# Altium project fMUX_MB.PrjPCB (part 4 of 6)

## Sheet Mezz1.SchDoc: FPGA Motherboard for Digital Multiplexed Readout, McGill U.
size B; DocumentNumber: DfMUX26; Revision: Rev0, Prototype; SheetNumber: 26; SheetTotal: 27; PageSetup: Record=PageOptions|CenterHorizontal=True|CenterVertical=True|PrintScale=1.08|XCorrection=1.00|YCorrection=1.00|PrintKind=0|BorderSize=5000000|LeftOffset=0|BottomOffset=0|Orientation=2|PaperLength=1000|PaperWidth=1000|Scale=100|PaperSource=7|PrintQuality=-4|MediaType=1|DitherType=10|PaperKind=Tabloid|PrintScaleMode=1
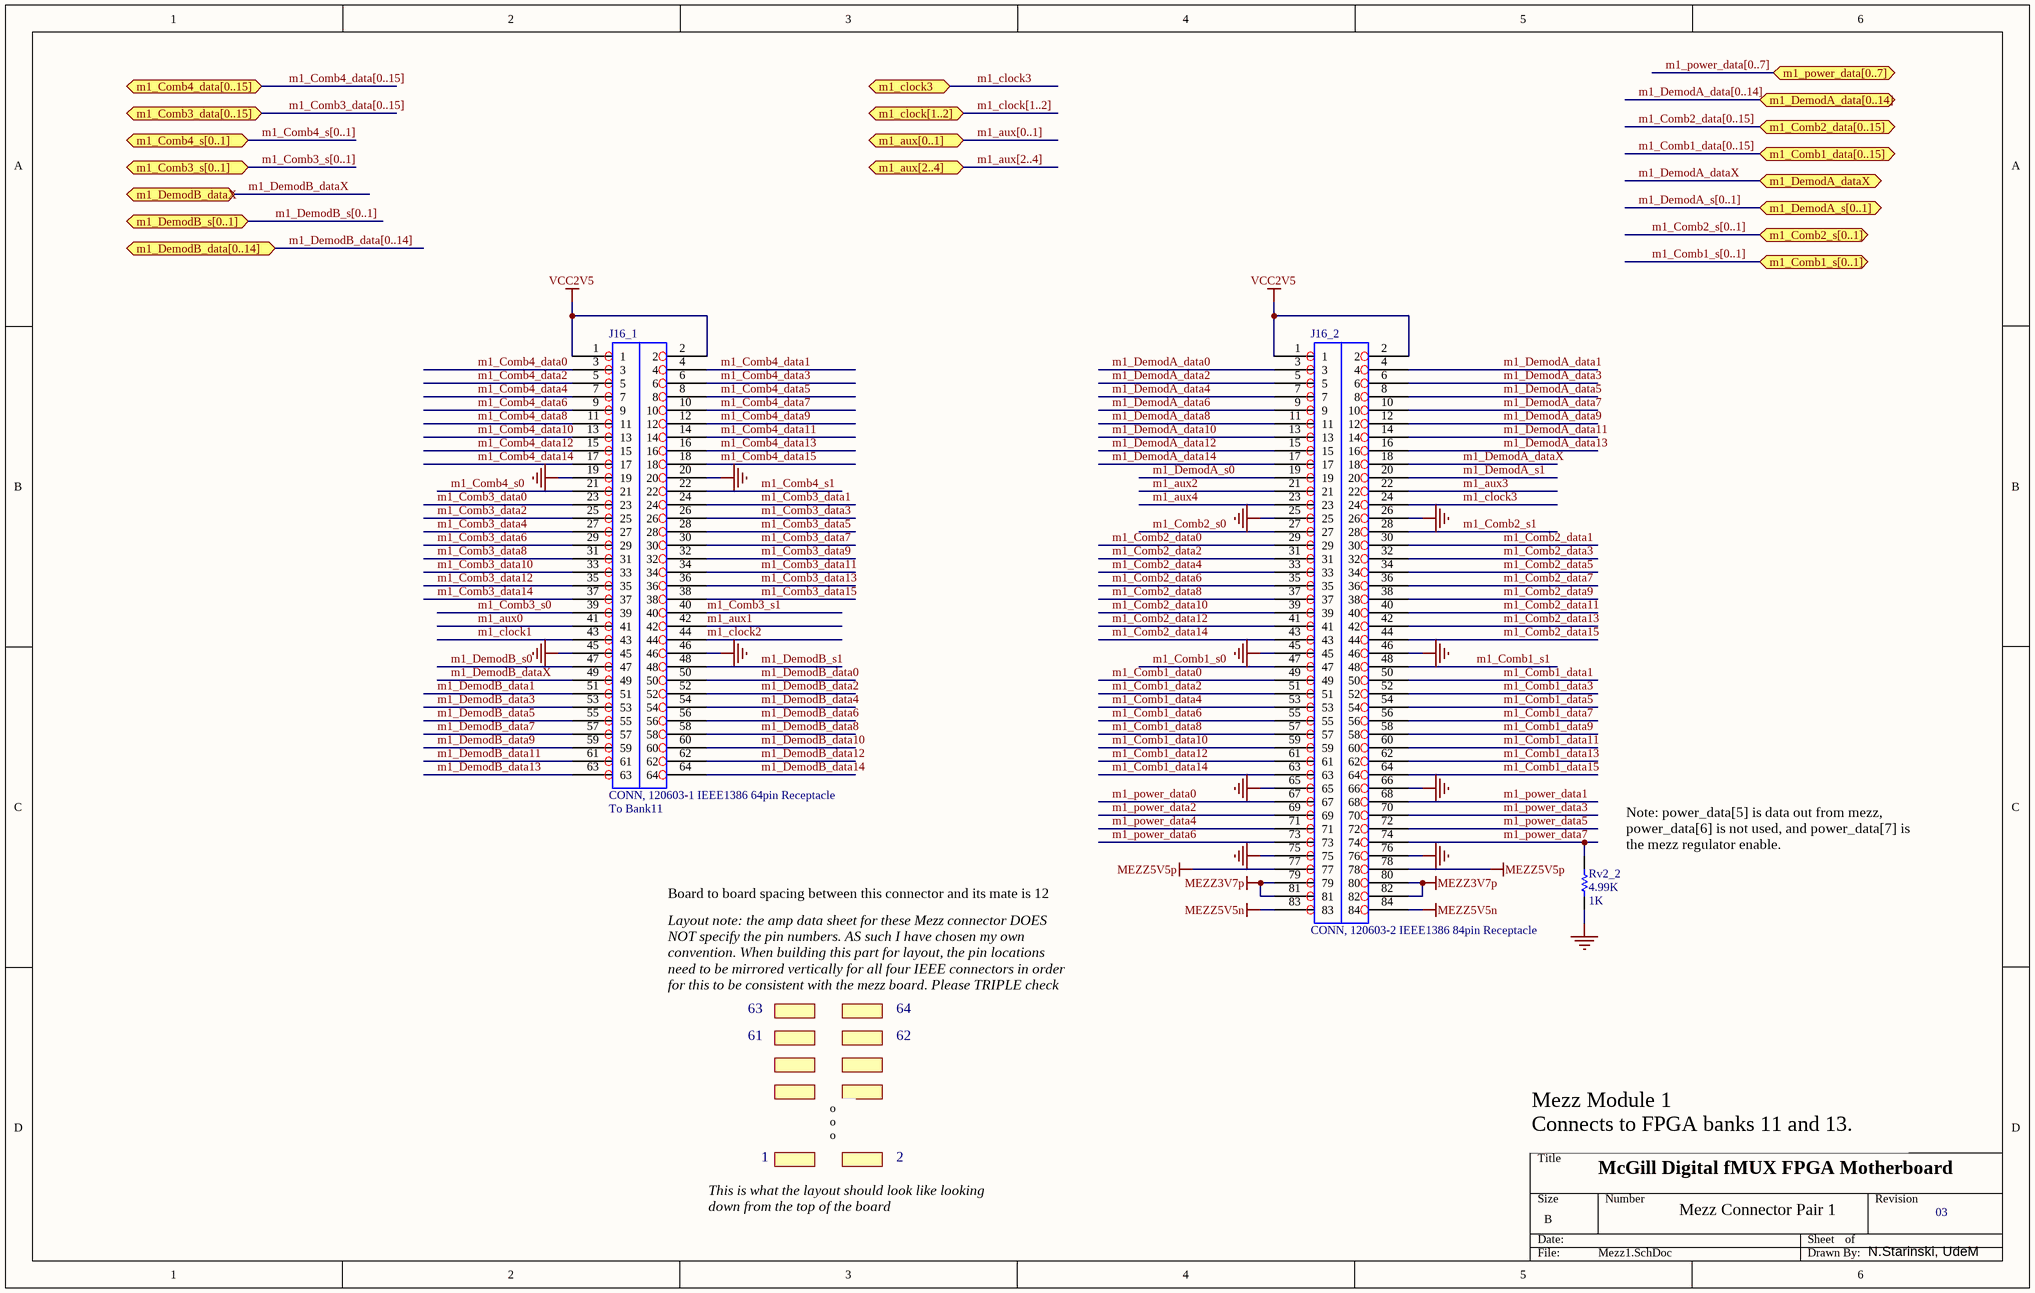
[diagram p20: Mezz1.SchDoc]

### Parts
J16_1  CONN, 120603-1 IEEE1386 64pin Receptacle  Relation: To Bank11  [120603-1]
J16_2  CONN, 120603-2 IEEE1386 84pin Receptacle  [120603-2]
Rv2_2  4.99K  value 1K  [1608[0603]]

### Ports
m1_aux[0..1] (bidir), m1_aux[2..4] (bidir), m1_clock3 (bidir), m1_clock[1..2] (bidir), m1_Comb1_data[0..15] (bidir), m1_Comb1_s[0..1] (bidir), m1_Comb2_data[0..15] (bidir), m1_Comb2_s[0..1] (bidir), m1_Comb3_data[0..15] (bidir), m1_Comb3_s[0..1] (bidir), m1_Comb4_data[0..15] (bidir), m1_Comb4_s[0..1] (bidir), m1_DemodA_data[0..14] (bidir), m1_DemodA_dataX (bidir), m1_DemodA_s[0..1] (bidir), m1_DemodB_data[0..14] (bidir), m1_DemodB_dataX (bidir), m1_DemodB_s[0..1] (bidir), m1_power_data[0..7]

### Nets
GND: J16_1.19 J16_1.20 J16_1.45 J16_1.46 J16_2.25 J16_2.26 J16_2.45 J16_2.46 J16_2.65 J16_2.66 J16_2.75 J16_2.76 Rv2_2.1
MEZZ3V7p: J16_2.79 J16_2.80 J16_2.81 J16_2.82  [project net Vout1]
MEZZ5V5n: J16_2.83 J16_2.84  [project net INT5V5n]
MEZZ5V5p: J16_2.77 J16_2.78  [project net INT5V5p]
VCC2V5: J16_1.1 J16_1.2 J16_2.1 J16_2.2  [project net Vout2]
m1_aux0: J16_1.41
m1_aux1: J16_1.42
m1_aux2: J16_2.21
m1_aux3: J16_2.22
m1_aux4: J16_2.23
m1_clock1: J16_1.43
m1_clock2: J16_1.44
m1_clock3: J16_2.24 ; port m1_clock3
m1_Comb1_data0: J16_2.49
m1_Comb1_data1: J16_2.50
m1_Comb1_data2: J16_2.51
m1_Comb1_data3: J16_2.52
m1_Comb1_data4: J16_2.53
m1_Comb1_data5: J16_2.54
m1_Comb1_data6: J16_2.55
m1_Comb1_data7: J16_2.56
m1_Comb1_data8: J16_2.57
m1_Comb1_data9: J16_2.58
m1_Comb1_data10: J16_2.59
m1_Comb1_data11: J16_2.60
m1_Comb1_data12: J16_2.61
m1_Comb1_data13: J16_2.62
m1_Comb1_data14: J16_2.63
m1_Comb1_data15: J16_2.64
m1_Comb1_s0: J16_2.47
m1_Comb1_s1: J16_2.48
m1_Comb2_data0: J16_2.29
m1_Comb2_data1: J16_2.30
m1_Comb2_data2: J16_2.31
m1_Comb2_data3: J16_2.32
m1_Comb2_data4: J16_2.33
m1_Comb2_data5: J16_2.34
m1_Comb2_data6: J16_2.35
m1_Comb2_data7: J16_2.36
m1_Comb2_data8: J16_2.37
m1_Comb2_data9: J16_2.38
m1_Comb2_data10: J16_2.39
m1_Comb2_data11: J16_2.40
m1_Comb2_data12: J16_2.41
m1_Comb2_data13: J16_2.42
m1_Comb2_data14: J16_2.43
m1_Comb2_data15: J16_2.44
m1_Comb2_s0: J16_2.27
m1_Comb2_s1: J16_2.28
m1_Comb3_data0: J16_1.23
m1_Comb3_data1: J16_1.24
m1_Comb3_data2: J16_1.25
m1_Comb3_data3: J16_1.26
m1_Comb3_data4: J16_1.27
m1_Comb3_data5: J16_1.28
m1_Comb3_data6: J16_1.29
m1_Comb3_data7: J16_1.30
m1_Comb3_data8: J16_1.31
m1_Comb3_data9: J16_1.32
m1_Comb3_data10: J16_1.33
m1_Comb3_data11: J16_1.34
m1_Comb3_data12: J16_1.35
m1_Comb3_data13: J16_1.36
m1_Comb3_data14: J16_1.37
m1_Comb3_data15: J16_1.38
m1_Comb3_s0: J16_1.39
m1_Comb3_s1: J16_1.40
m1_Comb4_data0: J16_1.3
m1_Comb4_data1: J16_1.4
m1_Comb4_data2: J16_1.5
m1_Comb4_data3: J16_1.6
m1_Comb4_data4: J16_1.7
m1_Comb4_data5: J16_1.8
m1_Comb4_data6: J16_1.9
m1_Comb4_data7: J16_1.10
m1_Comb4_data8: J16_1.11
m1_Comb4_data9: J16_1.12
m1_Comb4_data10: J16_1.13
m1_Comb4_data11: J16_1.14
m1_Comb4_data12: J16_1.15
m1_Comb4_data13: J16_1.16
m1_Comb4_data14: J16_1.17
m1_Comb4_data15: J16_1.18
m1_Comb4_s0: J16_1.21
m1_Comb4_s1: J16_1.22
m1_DemodA_data0: J16_2.3
m1_DemodA_data1: J16_2.4
m1_DemodA_data2: J16_2.5
m1_DemodA_data3: J16_2.6
m1_DemodA_data4: J16_2.7
m1_DemodA_data5: J16_2.8
m1_DemodA_data6: J16_2.9
m1_DemodA_data7: J16_2.10
m1_DemodA_data8: J16_2.11
m1_DemodA_data9: J16_2.12
m1_DemodA_data10: J16_2.13
m1_DemodA_data11: J16_2.14
m1_DemodA_data12: J16_2.15
m1_DemodA_data13: J16_2.16
m1_DemodA_data14: J16_2.17
m1_DemodA_dataX: J16_2.18 ; port m1_DemodA_dataX
m1_DemodA_s0: J16_2.19
m1_DemodA_s1: J16_2.20
m1_DemodB_data0: J16_1.50
m1_DemodB_data1: J16_1.51
m1_DemodB_data2: J16_1.52
m1_DemodB_data3: J16_1.53
m1_DemodB_data4: J16_1.54
m1_DemodB_data5: J16_1.55
m1_DemodB_data6: J16_1.56
m1_DemodB_data7: J16_1.57
m1_DemodB_data8: J16_1.58
m1_DemodB_data9: J16_1.59
m1_DemodB_data10: J16_1.60
m1_DemodB_data11: J16_1.61
m1_DemodB_data12: J16_1.62
m1_DemodB_data13: J16_1.63
m1_DemodB_data14: J16_1.64
m1_DemodB_dataX: J16_1.49 ; port m1_DemodB_dataX
m1_DemodB_s0: J16_1.47
m1_DemodB_s1: J16_1.48
m1_power_data0: J16_2.67
m1_power_data1: J16_2.68
m1_power_data2: J16_2.69
m1_power_data3: J16_2.70
m1_power_data4: J16_2.71
m1_power_data5: J16_2.72
m1_power_data6: J16_2.73
m1_power_data7: J16_2.74 Rv2_2.2

### Buses and harness runs
bus m1_aux[0..1] = port m1_aux[0..1]
bus m1_aux[2..4] = port m1_aux[2..4]
bus m1_clock[1..2] = port m1_clock[1..2]
bus m1_Comb1_data[0..15] = port m1_Comb1_data[0..15]
bus m1_Comb1_s[0..1] = port m1_Comb1_s[0..1]
bus m1_Comb2_data[0..15] = port m1_Comb2_data[0..15]
bus m1_Comb2_s[0..1] = port m1_Comb2_s[0..1]
bus m1_Comb3_data[0..15] = port m1_Comb3_data[0..15]
bus m1_Comb3_s[0..1] = port m1_Comb3_s[0..1]
bus m1_Comb4_data[0..15] = port m1_Comb4_data[0..15]
bus m1_Comb4_s[0..1] = port m1_Comb4_s[0..1]
bus m1_DemodA_data[0..14] = port m1_DemodA_data[0..14]
bus m1_DemodA_s[0..1] = port m1_DemodA_s[0..1]
bus m1_DemodB_data[0..14] = port m1_DemodB_data[0..14]
bus m1_DemodB_s[0..1] = port m1_DemodB_s[0..1]
bus m1_power_data[0..7] = port m1_power_data[0..7]

### Notes on the sheet
- Board to board spacing between this connector and its mate is 12 mm.
- (near Rv2_2) Note: power_data[5] is data out from mezz, power_data[6] is not used, and power_data[7] is the mezz regulator enable.
- Layout note: the amp data sheet for these Mezz connector DOES NOT specify the pin numbers. AS such I have chosen my own convention. When building this part for layout, the pin locations need to be mirrored vertically for all four IEEE connectors in order for this to be consistent with the mezz board. Please TRIPLE check that it mates properly with the mezz cards.
- 61
- 63
- 62
- 64
- 1
- o
  o
  o
- 2
- Mezz Module 1
  Connects to FPGA banks 11 and 13.
  Located on SYSACE side of board.
- McGill Digital fMUX FPGA Motherboard
- This is what the layout should look like looking down from the top of the board
- Mezz Connector Pair 1
- 03
- N.Starinski, UdeM

### Library data of the parts
J16_1 = 120603-1: 1.0mm FH (IEEE1386) 64-pin Connector
J16_2 = 120603-2: 1.0mm FH (IEEE1386) 84-pin Connector
Rv2_2 = Res Semi: Semiconductor Resistor; Published: 8-Jun-2000; LatestRevisionDate: 17-Jul-2002; LatestRevisionNote: Re-released for DXP Platform.; PackageReference: AXIAL-0.5; Publisher: Altium Limited

## Sheet Mezz2.SchDoc: FPGA Motherboard for Digital Multiplexed Readout, McGill U.
size B; DocumentNumber: DfMUX27; Revision: Rev0, Prototype; SheetNumber: 27; SheetTotal: 27; PageSetup: Record=PageOptions|CenterHorizontal=True|CenterVertical=True|PrintScale=1.08|XCorrection=1.00|YCorrection=1.00|PrintKind=0|BorderSize=5000000|LeftOffset=0|BottomOffset=0|Orientation=2|PaperLength=1000|PaperWidth=1000|Scale=100|PaperSource=7|PrintQuality=-4|MediaType=1|DitherType=10|PaperKind=Tabloid|PrintScaleMode=1
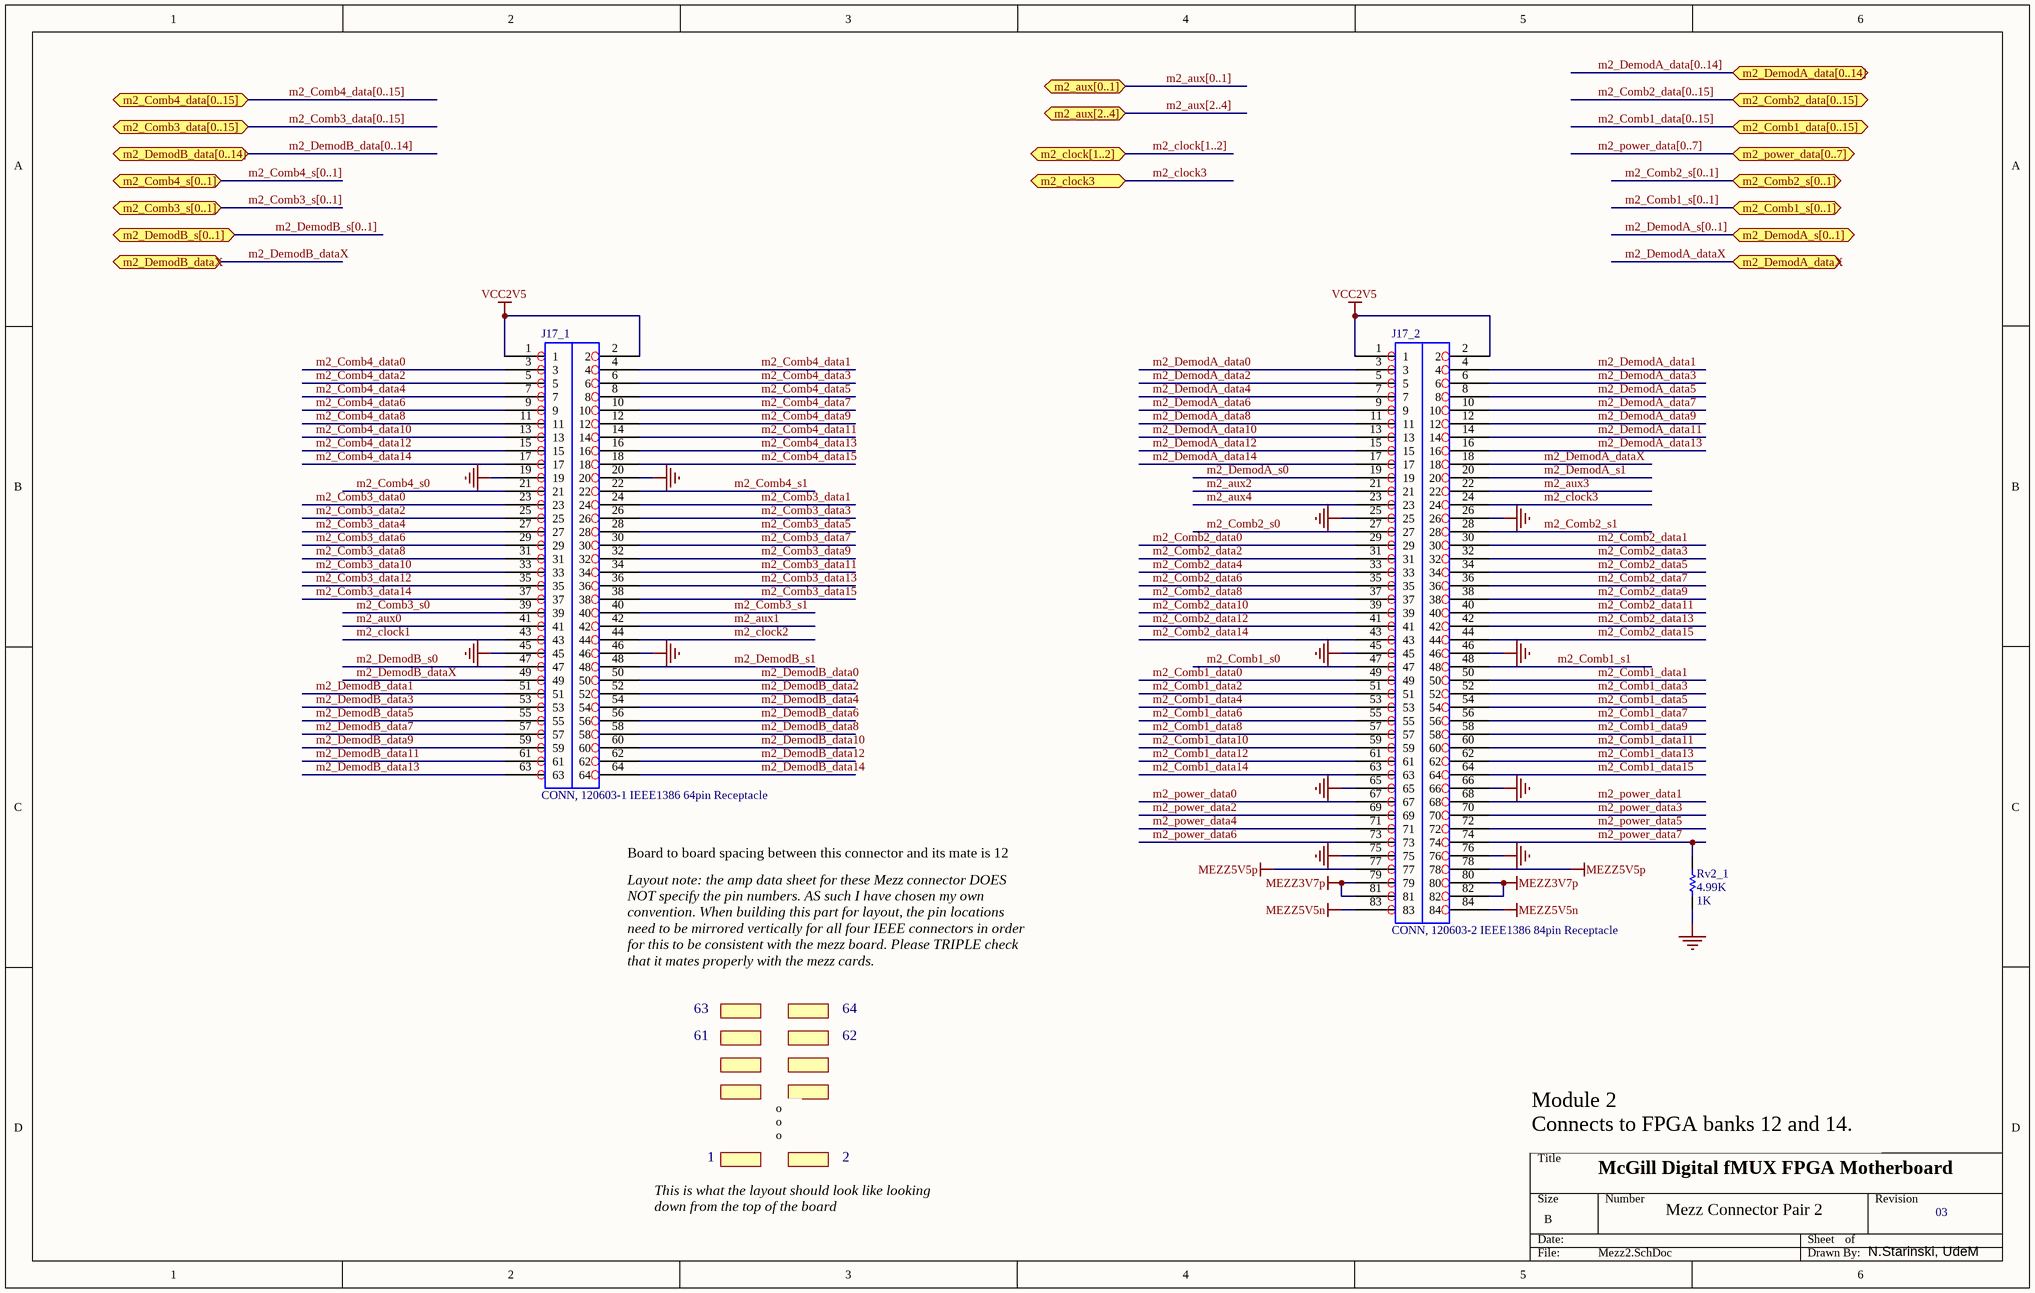
[diagram p21: Mezz2.SchDoc]

### Parts
J17_1  CONN, 120603-1 IEEE1386 64pin Receptacle  [120603-1]
J17_2  CONN, 120603-2 IEEE1386 84pin Receptacle  [120603-2]
Rv2_1  4.99K  value 1K  [1608[0603]]

### Ports
m2_aux[0..1] (bidir), m2_aux[2..4] (bidir), m2_clock3 (bidir), m2_clock[1..2] (bidir), m2_Comb1_data[0..15] (bidir), m2_Comb1_s[0..1] (bidir), m2_Comb2_data[0..15] (bidir), m2_Comb2_s[0..1] (bidir), m2_Comb3_data[0..15] (bidir), m2_Comb3_s[0..1] (bidir), m2_Comb4_data[0..15] (bidir), m2_Comb4_s[0..1] (bidir), m2_DemodA_data[0..14] (bidir), m2_DemodA_dataX (bidir), m2_DemodA_s[0..1] (bidir), m2_DemodB_data[0..14] (bidir), m2_DemodB_dataX (bidir), m2_DemodB_s[0..1] (bidir), m2_power_data[0..7] (bidir)

### Nets
GND: J17_1.19 J17_1.20 J17_1.45 J17_1.46 J17_2.25 J17_2.26 J17_2.45 J17_2.46 J17_2.65 J17_2.66 J17_2.75 J17_2.76 Rv2_1.1
MEZZ3V7p: J17_2.79 J17_2.80 J17_2.81 J17_2.82  [project net Vout1]
MEZZ5V5n: J17_2.83 J17_2.84  [project net INT5V5n]
MEZZ5V5p: J17_2.77 J17_2.78  [project net INT5V5p]
VCC2V5: J17_1.1 J17_1.2 J17_2.1 J17_2.2  [project net Vout2]
m2_aux0: J17_1.41
m2_aux1: J17_1.42
m2_aux2: J17_2.21
m2_aux3: J17_2.22
m2_aux4: J17_2.23
m2_clock1: J17_1.43
m2_clock2: J17_1.44
m2_clock3: J17_2.24 ; port m2_clock3
m2_Comb1_data0: J17_2.49
m2_Comb1_data1: J17_2.50
m2_Comb1_data2: J17_2.51
m2_Comb1_data3: J17_2.52
m2_Comb1_data4: J17_2.53
m2_Comb1_data5: J17_2.54
m2_Comb1_data6: J17_2.55
m2_Comb1_data7: J17_2.56
m2_Comb1_data8: J17_2.57
m2_Comb1_data9: J17_2.58
m2_Comb1_data10: J17_2.59
m2_Comb1_data11: J17_2.60
m2_Comb1_data12: J17_2.61
m2_Comb1_data13: J17_2.62
m2_Comb1_data14: J17_2.63
m2_Comb1_data15: J17_2.64
m2_Comb1_s0: J17_2.47
m2_Comb1_s1: J17_2.48
m2_Comb2_data0: J17_2.29
m2_Comb2_data1: J17_2.30
m2_Comb2_data2: J17_2.31
m2_Comb2_data3: J17_2.32
m2_Comb2_data4: J17_2.33
m2_Comb2_data5: J17_2.34
m2_Comb2_data6: J17_2.35
m2_Comb2_data7: J17_2.36
m2_Comb2_data8: J17_2.37
m2_Comb2_data9: J17_2.38
m2_Comb2_data10: J17_2.39
m2_Comb2_data11: J17_2.40
m2_Comb2_data12: J17_2.41
m2_Comb2_data13: J17_2.42
m2_Comb2_data14: J17_2.43
m2_Comb2_data15: J17_2.44
m2_Comb2_s0: J17_2.27
m2_Comb2_s1: J17_2.28
m2_Comb3_data0: J17_1.23
m2_Comb3_data1: J17_1.24
m2_Comb3_data2: J17_1.25
m2_Comb3_data3: J17_1.26
m2_Comb3_data4: J17_1.27
m2_Comb3_data5: J17_1.28
m2_Comb3_data6: J17_1.29
m2_Comb3_data7: J17_1.30
m2_Comb3_data8: J17_1.31
m2_Comb3_data9: J17_1.32
m2_Comb3_data10: J17_1.33
m2_Comb3_data11: J17_1.34
m2_Comb3_data12: J17_1.35
m2_Comb3_data13: J17_1.36
m2_Comb3_data14: J17_1.37
m2_Comb3_data15: J17_1.38
m2_Comb3_s0: J17_1.39
m2_Comb3_s1: J17_1.40
m2_Comb4_data0: J17_1.3
m2_Comb4_data1: J17_1.4
m2_Comb4_data2: J17_1.5
m2_Comb4_data3: J17_1.6
m2_Comb4_data4: J17_1.7
m2_Comb4_data5: J17_1.8
m2_Comb4_data6: J17_1.9
m2_Comb4_data7: J17_1.10
m2_Comb4_data8: J17_1.11
m2_Comb4_data9: J17_1.12
m2_Comb4_data10: J17_1.13
m2_Comb4_data11: J17_1.14
m2_Comb4_data12: J17_1.15
m2_Comb4_data13: J17_1.16
m2_Comb4_data14: J17_1.17
m2_Comb4_data15: J17_1.18
m2_Comb4_s0: J17_1.21
m2_Comb4_s1: J17_1.22
m2_DemodA_data0: J17_2.3
m2_DemodA_data1: J17_2.4
m2_DemodA_data2: J17_2.5
m2_DemodA_data3: J17_2.6
m2_DemodA_data4: J17_2.7
m2_DemodA_data5: J17_2.8
m2_DemodA_data6: J17_2.9
m2_DemodA_data7: J17_2.10
m2_DemodA_data8: J17_2.11
m2_DemodA_data9: J17_2.12
m2_DemodA_data10: J17_2.13
m2_DemodA_data11: J17_2.14
m2_DemodA_data12: J17_2.15
m2_DemodA_data13: J17_2.16
m2_DemodA_data14: J17_2.17
m2_DemodA_dataX: J17_2.18 ; port m2_DemodA_dataX
m2_DemodA_s0: J17_2.19
m2_DemodA_s1: J17_2.20
m2_DemodB_data0: J17_1.50
m2_DemodB_data1: J17_1.51
m2_DemodB_data2: J17_1.52
m2_DemodB_data3: J17_1.53
m2_DemodB_data4: J17_1.54
m2_DemodB_data5: J17_1.55
m2_DemodB_data6: J17_1.56
m2_DemodB_data7: J17_1.57
m2_DemodB_data8: J17_1.58
m2_DemodB_data9: J17_1.59
m2_DemodB_data10: J17_1.60
m2_DemodB_data11: J17_1.61
m2_DemodB_data12: J17_1.62
m2_DemodB_data13: J17_1.63
m2_DemodB_data14: J17_1.64
m2_DemodB_dataX: J17_1.49 ; port m2_DemodB_dataX
m2_DemodB_s0: J17_1.47
m2_DemodB_s1: J17_1.48
m2_power_data0: J17_2.67
m2_power_data1: J17_2.68
m2_power_data2: J17_2.69
m2_power_data3: J17_2.70
m2_power_data4: J17_2.71
m2_power_data5: J17_2.72
m2_power_data6: J17_2.73
m2_power_data7: J17_2.74 Rv2_1.2

### Buses and harness runs
bus m2_aux[0..1] = port m2_aux[0..1]
bus m2_aux[2..4] = port m2_aux[2..4]
bus m2_clock[1..2] = port m2_clock[1..2]
bus m2_Comb1_data[0..15] = port m2_Comb1_data[0..15]
bus m2_Comb1_s[0..1] = port m2_Comb1_s[0..1]
bus m2_Comb2_data[0..15] = port m2_Comb2_data[0..15]
bus m2_Comb2_s[0..1] = port m2_Comb2_s[0..1]
bus m2_Comb3_data[0..15] = port m2_Comb3_data[0..15]
bus m2_Comb3_s[0..1] = port m2_Comb3_s[0..1]
bus m2_Comb4_data[0..15] = port m2_Comb4_data[0..15]
bus m2_Comb4_s[0..1] = port m2_Comb4_s[0..1]
bus m2_DemodA_data[0..14] = port m2_DemodA_data[0..14]
bus m2_DemodA_s[0..1] = port m2_DemodA_s[0..1]
bus m2_DemodB_data[0..14] = port m2_DemodB_data[0..14]
bus m2_DemodB_s[0..1] = port m2_DemodB_s[0..1]
bus m2_power_data[0..7] = port m2_power_data[0..7]

### Notes on the sheet
- Board to board spacing between this connector and its mate is 12 mm.
- Layout note: the amp data sheet for these Mezz connector DOES NOT specify the pin numbers. AS such I have chosen my own convention. When building this part for layout, the pin locations need to be mirrored vertically for all four IEEE connectors in order for this to be consistent with the mezz board. Please TRIPLE check that it mates properly with the mezz cards.
- 61
- 63
- 62
- 64
- 1
- o
  o
  o
- 2
- Module 2
  Connects to FPGA banks 12 and 14.
  Located on DDR side of board.
- McGill Digital fMUX FPGA Motherboard
- This is what the layout should look like looking down from the top of the board
- Mezz Connector Pair 2
- 03
- N.Starinski, UdeM

### Library data of the parts
J17_1 = 120603-1: 1.0mm FH (IEEE1386) 64-pin Connector
J17_2 = 120603-2: 1.0mm FH (IEEE1386) 84-pin Connector
Rv2_1 = Res Semi: Semiconductor Resistor; Published: 8-Jun-2000; LatestRevisionDate: 17-Jul-2002; LatestRevisionNote: Re-released for DXP Platform.; PackageReference: AXIAL-0.5; Publisher: Altium Limited

## Sheet SysACE_SysFLASH.SchDoc: FPGA Motherboard for Digital Multiplexed Readout, McGill U.
size B; DocumentNumber: DfMUX10; Revision: Rev0, Prototype; SheetNumber: 10; SheetTotal: 27; PageSetup: Record=PageOptions|CenterHorizontal=True|CenterVertical=True|PrintScale=1.08|XCorrection=1.00|YCorrection=1.00|PrintKind=0|BorderSize=5000000|LeftOffset=0|BottomOffset=0|Orientation=2|PaperLength=1000|PaperWidth=1000|Scale=100|PaperSource=7|PrintQuality=-4|MediaType=1|DitherType=10|PaperKind=Tabloid|PrintScaleMode=1
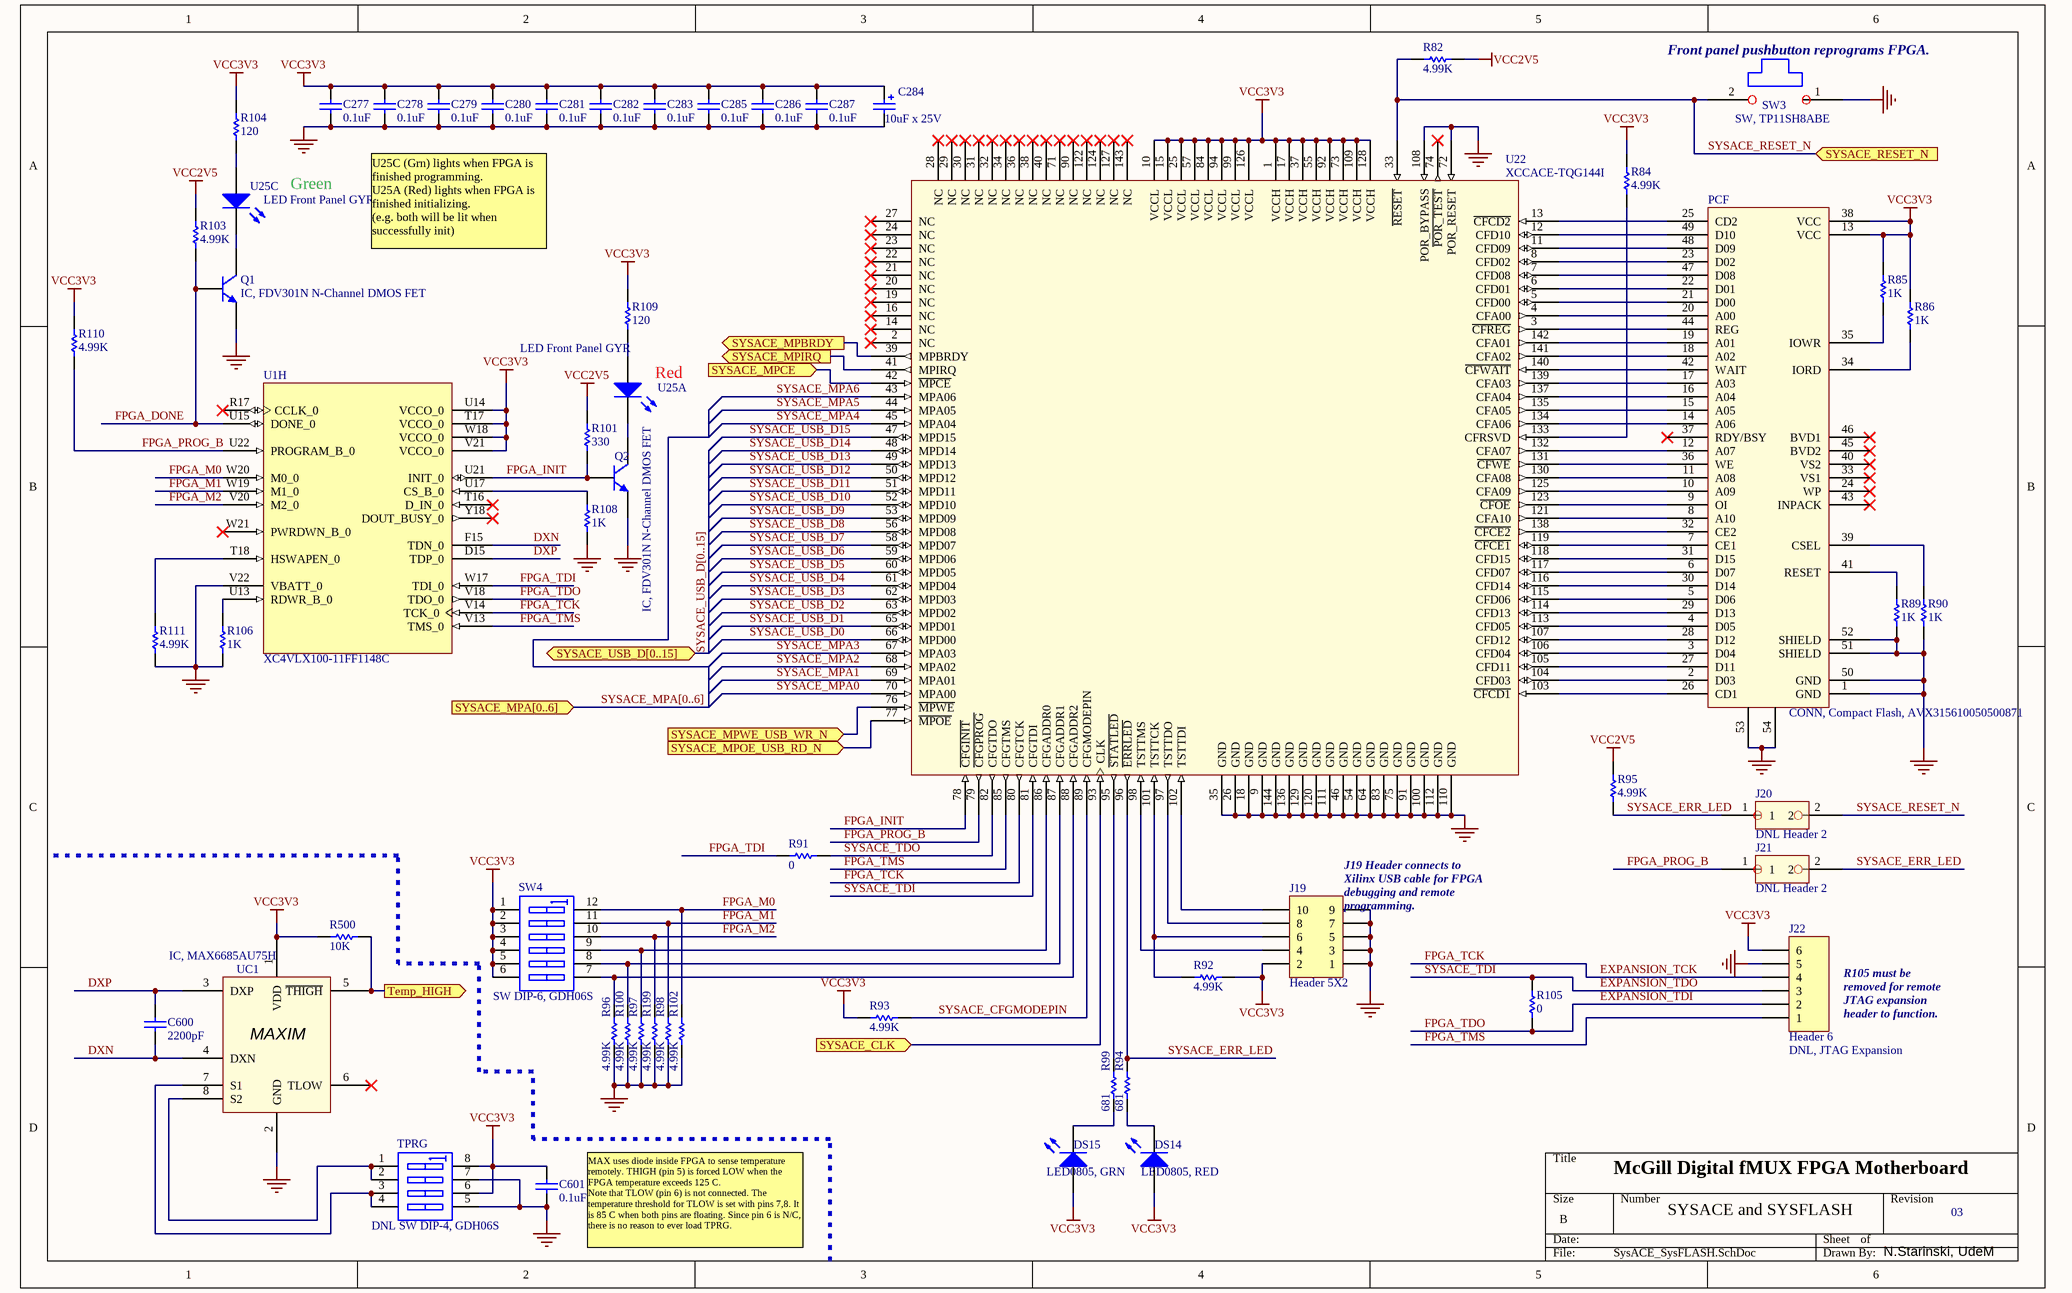
[diagram p22: SysACE_SysFLASH.SchDoc]

### Parts
C277  0.1uF  [CC1608-0603]
C278  0.1uF  [CC1608-0603]
C279  0.1uF  [CC1608-0603]
C280  0.1uF  [CC1608-0603]
C281  0.1uF  [CC1608-0603]
C282  0.1uF  [CC1608-0603]
C283  0.1uF  [CC1608-0603]
C284  10uF x 25V  [TC6032-2412]
C285  0.1uF  [CC1608-0603]
C286  0.1uF  [CC1608-0603]
C287  0.1uF  [CC1608-0603]
C600  2200pF  [CC1608-0603]
C601  0.1uF  [CC1608-0603]
DS14  LED0805, RED  [SMD _LED]
DS15  LED0805, GRN  [SMD _LED]
J19  Header 5X2  [HDR2X5]
J20  DNL Header 2  [HDR1X2]
J21  DNL Header 2  [HDR1X2]
J22  Header 6  Assembly: DNL, JTAG Expansion  [HDR1X6]
PCF  CONN, Compact Flash, AVX315610050500871  [CF_AVX5611]
Q1  IC, FDV301N N-Channel DMOS FET  [SOT23]
Q2  IC, FDV301N N-Channel DMOS FET  [SOT23]
R82  4.99K  [CR1608-0603]
R84  4.99K  [CR1608-0603]
R85  1K  [CR1608-0603]
R86  1K  [CR1608-0603]
R89  1K  [CR1608-0603]
R90  1K  [CR1608-0603]
R91  0  [CR1608-0603]
R92  4.99K  [CR1608-0603]
R93  4.99K  [CR1608-0603]
R94  681  [CR1608-0603]
R95  4.99K  [CR1608-0603]
R96  4.99K  [CR1608-0603]
R97  4.99K  [CR1608-0603]
R98  4.99K  [CR1608-0603]
R99  681  [CR1608-0603]
R100  4.99K  [CR1608-0603]
R101  330  [CR1608-0603]
R102  4.99K  [CR1608-0603]
R103  4.99K  [CR1608-0603]
R104  120  [CR1608-0603]
R105  0  [CR1608-0603]
R106  1K  [CR1608-0603]
R108  1K  [CR1608-0603]
R109  120  [CR1608-0603]
R110  4.99K  [CR1608-0603]
R111  4.99K  [CR1608-0603]
R199  4.99K  [CR1608-0603]
R500  10K  [CR1608-0603]
SW3  SW, TP11SH8ABE  [TP11SH8ABE]
SW4  SW DIP-6, GDH06S  [DIP_SW_SM6POS]
TPRG  DNL SW DIP-4, GDH06S  [SO-G8]
U1  XC4VLX100-11FF1148C  [FF1148]  (part H of 10)
U22  XCCACE-TQG144I  [TQFP144]
U25  LED Front Panel GYR  [LED_Tri_]  (parts A,C of 3)
UC1  IC, MAX6685AU75H  [uSOP8]

### Ports
SYSACE_CLK (in), SYSACE_MPA[0..6] (in), SYSACE_MPBRDY (out), SYSACE_MPCE (in), SYSACE_MPIRQ (out), SYSACE_MPOE_USB_RD_N (in), SYSACE_MPWE_USB_WR_N (in), SYSACE_RESET_N (in), SYSACE_USB_D[0..15], Temp_HIGH (out)

### Nets
GND: C277.1 C278.1 C279.1 C280.1 C281.1 C282.1 C283.1 C284.2 C285.1 C286.1 C287.1 C601.1 J19.1 J19.3 J19.5 J19.7 J19.9 J22.5 PCF.1(GND) PCF.50(GND) PCF.51(SHIELD) PCF.52(SHIELD) PCF.53(GND) PCF.54(GND) Q1.2(E) Q2.2(E) R89.1 R90.1 R96.1 R97.1 R98.1 R100.1 R102.1 R106.1 R108.1 R111.1 R199.1 SW3.1 TPRG.5(B4) TPRG.7(B2) U1.V22(VBATT_0) U22.9(GND) U22.18(GND) U22.26(GND) U22.35(GND) U22.46(GND) U22.54(GND) U22.64(GND) U22.72(POR_RESET) U22.75(GND) U22.83(GND) U22.91(GND) U22.100(GND) U22.108(POR_BYPASS) U22.110(GND) U22.111(GND) U22.112(GND) U22.120(GND) U22.129(GND) U22.136(GND) U22.144(GND) UC1.2(GND)
VCC2V5: R82.2 R95.2 R101.2 R103.2  [project net Vout2]
VCC3V3: C277.2 C278.2 C279.2 C280.2 C281.2 C282.2 C283.2 C284.1 C285.2 C286.2 C287.2 C601.2 DS14.1(A) DS15.1(A) J19.2 J22.6 PCF.13(VCC) PCF.38(VCC) R84.2 R85.2 R86.2 R92.2 R93.1 R104.2 R109.2 R110.2 R500.1 SW4.1(A1) SW4.2(A2) SW4.3(A3) SW4.4(A4) SW4.5(A5) SW4.6(A6) TPRG.6(B3) TPRG.8(B1) U1.T17(VCCO_0) U1.U14(VCCO_0) U1.V21(VCCO_0) U1.W18(VCCO_0) U22.1(VCCH) U22.10(VCCL) U22.15(VCCL) U22.17(VCCH) U22.25(VCCL) U22.37(VCCH) U22.55(VCCH) U22.57(VCCL) U22.73(VCCH) U22.84(VCCL) U22.92(VCCH) U22.94(VCCL) U22.99(VCCL) U22.109(VCCH) U22.126(VCCL) U22.128(VCCH) UC1.1(VDD)
DXN: C600.1 U1.F15(TDN_0) UC1.4(DXN)  [project net DXN_10]
DXP: C600.2 U1.D15(TDP_0) UC1.3(DXP)  [project net DXP_10]
EXPANSION_TCK: J22.4 U1.V14(TCK_0) U22.80(CFGTCK)  [also labelled FPGA_TCK]  [project net EXPANSION_TCK_10]
EXPANSION_TDI: J22.2 R105.1 U1.V18(TDO_0)  [also labelled FPGA_TDO]  [project net EXPANSION_TDI_10]
EXPANSION_TDO: J22.3 R105.2 U22.81(CFGTDI)  [also labelled SYSACE_TDI]  [project net EXPANSION_TDO_10]
FPGA_DONE: Q1.1(B) R103.1 U1.U15(DONE_0)  [project net FPGA_DONE_10]
FPGA_INIT: Q2.1(B) R101.1 U1.U21(INIT_0) U22.78(~{CFGINIT})  [project net FPGA_INIT_10]
FPGA_M0: R102.2 SW4.12(B1) U1.W20(M0_0)  [project net FPGA_M0_10]
FPGA_M1: R98.2 SW4.11(B2) U1.W19(M1_0)  [project net FPGA_M1_10]
FPGA_M2: R199.2 SW4.10(B3) U1.V20(M2_0)  [project net FPGA_M2_10]
FPGA_PROG_B: J21.1 R110.1 U1.U22(PROGRAM_B_0) U22.79(~{CFGPROG})  [project net FPGA_PROG_B_10]
FPGA_TDI: R91.1 U1.W17(TDI_0)  [project net FPGA_TDI_10]
FPGA_TMS: J22.1 U1.V13(TMS_0) U22.85(CFGTMS)  [project net FPGA_TMS_10]
SYSACE_CFGMODEPIN: R93.2 U22.89(CFGMODEPIN)  [project net SYSACE_CFGMODEPIN_10]
SYSACE_CLK: U22.93(CLK) ; port SYSACE_CLK
SYSACE_ERR_LED: J20.1 J21.2 R94.2 R95.1 U22.96(~{ERRLED})  [project net SYSACE_ERR_LED_10]
SYSACE_MPA0: U22.70(MPA00)
SYSACE_MPA1: U22.69(MPA01)
SYSACE_MPA2: U22.68(MPA02)
SYSACE_MPA3: U22.67(MPA03)
SYSACE_MPA4: U22.45(MPA04)
SYSACE_MPA5: U22.44(MPA05)
SYSACE_MPA6: U22.43(MPA06)
SYSACE_MPBRDY: U22.39(MPBRDY) ; port SYSACE_MPBRDY
SYSACE_MPCE: U22.42(~{MPCE}) ; port SYSACE_MPCE
SYSACE_MPIRQ: U22.41(MPIRQ) ; port SYSACE_MPIRQ
SYSACE_MPOE_USB_RD_N: U22.77(~{MPOE}) ; port SYSACE_MPOE_USB_RD_N
SYSACE_MPWE_USB_WR_N: U22.76(~{MPWE}) ; port SYSACE_MPWE_USB_WR_N
SYSACE_RESET_N: J20.2 R82.1 SW3.2 U22.33(~{RESET}) ; port SYSACE_RESET_N
SYSACE_TDO: R91.2 U22.82(CFGTDO)  [project net SYSACE_TDO_10]
SYSACE_USB_D0: U22.66(MPD00)
SYSACE_USB_D1: U22.65(MPD01)
SYSACE_USB_D2: U22.63(MPD02)
SYSACE_USB_D3: U22.62(MPD03)
SYSACE_USB_D4: U22.61(MPD04)
SYSACE_USB_D5: U22.60(MPD05)
SYSACE_USB_D6: U22.59(MPD06)
SYSACE_USB_D7: U22.58(MPD07)
SYSACE_USB_D8: U22.56(MPD08)
SYSACE_USB_D9: U22.53(MPD09)
SYSACE_USB_D10: U22.52(MPD10)
SYSACE_USB_D11: U22.51(MPD11)
SYSACE_USB_D12: U22.50(MPD12)
SYSACE_USB_D13: U22.49(MPD13)
SYSACE_USB_D14: U22.48(MPD14)
SYSACE_USB_D15: U22.47(MPD15)
Temp_HIGH: R500.2 UC1.5(~{THIGH}) ; port Temp_HIGH
NetDS14_2: DS14.2(K) R94.1
NetDS15_2: DS15.2(K) R99.1
NetJ19_4: J19.4 U22.98(TSTTMS)
NetJ19_6: J19.6 R92.1 U22.101(TSTTCK)
NetJ19_8: J19.8 U22.97(TSTTDO)
NetJ19_10: J19.10 U22.102(TSTTDI)
NetPCF_2: PCF.2(D03) U22.104(CFD03)
NetPCF_3: PCF.3(D04) U22.106(CFD04)
NetPCF_4: PCF.4(D05) U22.113(CFD05)
NetPCF_5: PCF.5(D06) U22.115(CFD06)
NetPCF_6: PCF.6(D07) U22.117(CFD07)
NetPCF_7: PCF.7(CE1) U22.119(~{CFCE1})
NetPCF_8: PCF.8(A10) U22.121(CFA10)
NetPCF_9: PCF.9(OI) U22.123(~{CFOE})
NetPCF_10: PCF.10(A09) U22.125(CFA09)
NetPCF_11: PCF.11(A08) U22.130(CFA08)
NetPCF_12: PCF.12(A07) U22.132(CFA07)
NetPCF_14: PCF.14(A06) U22.134(CFA06)
NetPCF_15: PCF.15(A05) U22.135(CFA05)
NetPCF_16: PCF.16(A04) U22.137(CFA04)
NetPCF_17: PCF.17(A03) U22.139(CFA03)
NetPCF_18: PCF.18(A02) U22.141(CFA02)
NetPCF_19: PCF.19(A01) U22.142(CFA01)
NetPCF_20: PCF.20(A00) U22.4(CFA00)
NetPCF_21: PCF.21(D00) U22.5(CFD00)
NetPCF_22: PCF.22(D01) U22.6(CFD01)
NetPCF_23: PCF.23(D02) U22.8(CFD02)
NetPCF_25: PCF.25(CD2) U22.13(~{CFCD2})
NetPCF_26: PCF.26(CD1) U22.103(~{CFCD1})
NetPCF_27: PCF.27(D11) U22.105(CFD11)
NetPCF_28: PCF.28(D12) U22.107(CFD12)
NetPCF_29: PCF.29(D13) U22.114(CFD13)
NetPCF_30: PCF.30(D14) U22.116(CFD14)
NetPCF_31: PCF.31(D15) U22.118(CFD15)
NetPCF_32: PCF.32(CE2) U22.138(~{CFCE2})
NetPCF_34: PCF.34(IORD) R86.1
NetPCF_35: PCF.35(IOWR) R85.1
NetPCF_36: PCF.36(WE) U22.131(~{CFWE})
NetPCF_39: PCF.39(CSEL) R90.2
NetPCF_41: PCF.41(RESET) R89.2
NetPCF_42: PCF.42(WAIT) U22.140(~{CFWAIT})
NetPCF_44: PCF.44(REG) U22.3(~{CFREG})
NetPCF_47: PCF.47(D08) U22.7(CFD08)
NetPCF_48: PCF.48(D09) U22.11(CFD09)
NetPCF_49: PCF.49(D10) U22.12(CFD10)
NetQ1_3: Q1.3(C) U25.K3(K)
NetQ2_3: Q2.3(C) U25.K1(K)
NetR84_1: R84.1 U22.133(CFRSVD)
NetR96_2: R96.2 SW4.7(B6) U22.88(CFGADDR2)
NetR97_2: R97.2 SW4.9(B4) U22.86(CFGADDR0)
NetR99_2: R99.2 U22.95(~{STATLED})
NetR100_2: R100.2 SW4.8(B5) U22.87(CFGADDR1)
NetR104_1: R104.1 U25.A3(A)
NetR106_2: R106.2 U1.U13(RDWR_B_0)
NetR108_2: R108.2 U1.U17(CS_B_0)
NetR109_1: R109.1 U25.A1(A)
NetR111_2: R111.2 U1.T18(HSWAPEN_0)
NetTPRG_1: TPRG.1(A1) TPRG.2(A2) UC1.8(S2)
NetTPRG_3: TPRG.3(A3) TPRG.4(A4) UC1.7(S1)

Not connected (* = marked no-connect by the designer): PCF 24(WP)* 33(VS1)* 37(RDY/BSY)* 40(VS2)* 43(INPACK)* 45(BVD2)* 46(BVD1)*; U1 R17(CCLK_0)* T16(D_IN_0)* W21(PWRDWN_B_0)* Y18(DOUT_BUSY_0)*; U22 2(NC)* 14(NC)* 16(NC)* 19(NC)* 20(NC)* 21(NC)* 22(NC)* 23(NC)* 24(NC)* 27(NC)* 28(NC)* 29(NC)* 30(NC)* 31(NC)* 32(NC)* 34(NC)* 36(NC)* 38(NC)* 40(NC)* 71(NC)* 74(~{POR_TEST})* 90(NC)* 122(NC)* 124(NC)* 127(NC)* 143(NC)*; UC1 6(TLOW)*

### Buses and harness runs
bus SYSACE_MPA[0..6] = port SYSACE_MPA[0..6]
bus SYSACE_USB_D[0..15] = port SYSACE_USB_D[0..15]

### Notes on the sheet
- (near SW3) Front panel pushbutton reprograms FPGA.
- Green
- U25C (Grn) lights when FPGA is finished programming.
  U25A (Red) lights when FPGA is finished initializing.
  (e.g. both will be lit when successfully init)
- Red
- Text
- (near J19) J19 Header connects to Xilinx USB cable for FPGA debugging and remote programming.
- R105 must be removed for remote JTAG expansion header to function.
- McGill Digital fMUX FPGA Motherboard
- (near C601) MAX uses diode inside FPGA to sense temperature remotely. THIGH (pin 5) is forced LOW when the FPGA temperature exceeds 125 C.
  Note that TLOW (pin 6) is not connected. The temperature threshold for TLOW is set with pins 7,8. It is 85 C when both pins are floating. Since pin 6 is N/C, there is no reason to ever load TPRG.
- SYSACE and SYSFLASH
- 03
- N.Starinski, UdeM
- (in symbol MAX6685) MAXIM

### Library data of the parts
C277-C283 C285-C287 C600 C601 = Cap Semi: Capacitor (Semiconductor SIM Model); Published: 8-Jun-2000; LatestRevisionDate: 17-Jul-2002; LatestRevisionNote: Re-released for DXP Platform.; PackageReference: C1206; Publisher: Altium Limited
C284 = Cap Pol3: CAP POL B45197A5106K309; Published: 8-Jun-2000; LatestRevisionDate: 17-Jul-2002; LatestRevisionNote: Re-released for DXP Platform.; PackageReference: C0805; Publisher: Altium Limited
DS14 = LED3: LED 0805 LTST-C170CKT; Published: 8-Jun-2000; LatestRevisionDate: 17-Dec-2003; LatestRevisionNote: PCB Footprint replaced.; Publisher: Altium Limited
DS15 = LED3: LED 0805 LTST-C170GKT; Published: 8-Jun-2000; LatestRevisionDate: 17-Dec-2003; LatestRevisionNote: PCB Footprint replaced.; Publisher: Altium Limited
J19 = Header 5X2: Header, 0.1" 5-Pin, Dual row straight; LatestRevisionDate: 17-Jul-2002; LatestRevisionNote: Re-released for DXP Platform.; Publisher: Altium Limited
J20 J21 = Jumper_100mil: Header, 0.1" 2-Pin straight; Assembly: DNL
J22 = Header 6: Header, 0.1" 6-Pin straight; LatestRevisionDate: 17-Jul-2002; LatestRevisionNote: Re-released for DXP Platform.; Publisher: Altium Limited
PCF = CF_Conn: Compact Flash Connector
Q1 Q2 = MMBT3904: NPN Switching Transistor; Published: 17-Sep-2003; DatasheetDocument: 13-May-2002; PackageDocument: May-1999; PackageReference: SOT23; Publisher: Altium Limited; ComponentLink1Description: Manufacturer Link; ComponentLink1URL: http://www.semiconductors.philips.com/; ComponentLink2Description: Datasheet; ComponentLink2URL: http://www.semiconductors.philips.com/acrobat/datasheets/MMBT3904_4.pdf
R82 R84-R86 R89-R106 R108-R111 R199 R500 = Res Semi: Resistor 0603; Published: 8-Jun-2000; LatestRevisionDate: 17-Jul-2002; LatestRevisionNote: Re-released for DXP Platform.; Publisher: Altium Limited
SW3 = Tiny Pushbutton Switch: Right angle PC trough
SW4 = SW DIP-6: DIP Switch, 6 Position, SPST; Published: 24-Mar-1999; LatestRevisionDate: 17-Jul-2002; LatestRevisionNote: Re-released for DXP Platform.; Publisher: Altium Limited
TPRG = SW DIP-4: DIP Switch, 4 Position, SPST; Published: 24-Mar-1999; LatestRevisionDate: 17-Jul-2002; LatestRevisionNote: Re-released for DXP Platform.; Publisher: Altium Limited; Code_JEDEC: MS-012-AA; Code_IPC: SO8
U1 = XC4VLX100-11FF1148C: Xilinx Virtex-4 LX Platform FPGA, 1148-Ball FFBGA, Speed Grade 11, 768 User I/Os, Commercial Grade; PackageDocument: ver1.0, Oct-2002; Published: 13-Dec-2004; LatestRevisionDate: 4-Mar-2005; LatestRevisionNote: D_IN & CS_B pins changed from I/O to Input. DOUT_BUSY pin changed from I/O to Output.; DatasheetDocument: ver1.2, Dec-2004; PackageReference: FF1148; Publisher: Altium Limited; ComponentLink2Description: Virtex-4 Overview; ComponentLink2URL: http://www.xilinx.com/products/virtex4/overview.htm; ComponentLink3Description: Datasheet; ComponentLink3URL: http://direct.xilinx.com/bvdocs/userguides/ug075.pdf; Code_JEDEC: MS-034-AAR-1
U22 = XCCACE-TQG144I: System ACE CF Xilinx
U25 = LED_Tri: 564-0200-132F
UC1 = MAX6685: Dual-Output Remote-Junction Temperature Switch

## Sheet Watchdog_Reset.SchDoc: FPGA Motherboard for Digital Multiplexed Readout, McGill U.
size A; DocumentNumber: DfMUX16; Revision: Rev0, Prototype; SheetNumber: 16; SheetTotal: 27; PageSetup: Record=PageOptions|CenterHorizontal=True|CenterVertical=True|PrintScale=0.73|XCorrection=1.00|YCorrection=1.00|PrintKind=0|BorderSize=5000000|LeftOffset=0|BottomOffset=0|Orientation=2|PaperLength=1000|PaperWidth=1000|Scale=100|PaperSource=7|PrintQuality=-4|MediaType=1|DitherType=10|PaperKind=Letter|PrintScaleMode=1
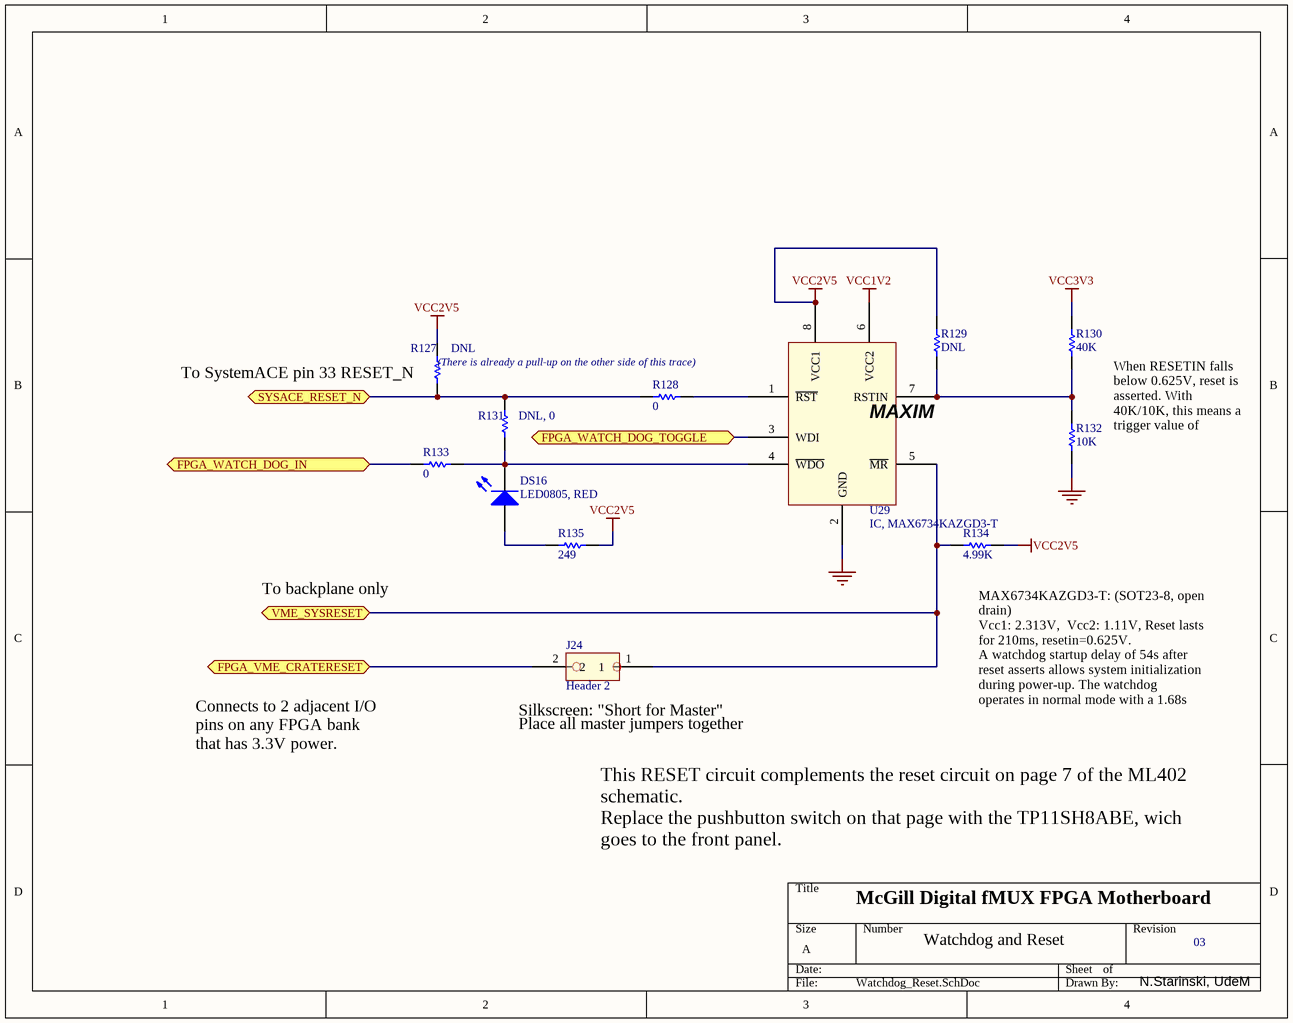
[diagram p23: Watchdog_Reset.SchDoc]

### Parts
DS16  LED0805, RED  [SMD _LED]
J24  Header 2  [HDR1X2]
R127  DNL  [CR1608-0603]
R128  0  [CR1608-0603]
R129  DNL  [CR1608-0603]
R130  40K  [CR1608-0603]
R131  DNL, 0  [CR1608-0603]
R132  10K  [CR1608-0603]
R133  0  [CR1608-0603]
R134  4.99K  [CR1608-0603]
R135  249  [CR1608-0603]
U29  IC, MAX6734KAZGD3-T  [SOP23-8]

### Ports
FPGA_VME_CRATERESET (bidir), FPGA_WATCH_DOG_IN (bidir), FPGA_WATCH_DOG_TOGGLE (bidir), SYSACE_RESET_N (bidir), VME_SYSRESET (bidir)

### Nets
GND: R132.1 U29.2(GND)
VCC1V2: U29.6(VCC2)  [project net Vout3]
VCC2V5: R127.2 R129.2 R134.2 R135.2 U29.8(VCC1)  [project net Vout2]
VCC3V3: R130.2
FDI: R133.1 ; port FPGA_WATCH_DOG_IN
FDT: U29.3(WDI) ; port FPGA_WATCH_DOG_TOGGLE
FVC: J24.2 ; port FPGA_VME_CRATERESET
SYSACE_RESET_N: R127.1 R128.1 R131.2 ; port SYSACE_RESET_N
VME_SYSRESET: J24.1 R134.1 U29.5(~{MR}) ; port VME_SYSRESET
NetDS16_1: DS16.1(A) R135.1
NetDS16_2: DS16.2(K) R131.1 R133.2 U29.4(~{WDO})
NetR128_2: R128.2 U29.1(~{RST})
NetR129_1: R129.1 R130.1 R132.2 U29.7(RSTIN)

### Notes on the sheet
- (near R127) (There is already a pull-up on the other side of this trace)
- (near R127) To SystemACE pin 33 RESET_N
- When RESETIN falls below 0.625V, reset is asserted. With 40K/10K, this means a trigger value of 3.125V.
- To backplane only
- (near R134) MAX6734KAZGD3-T: (SOT23-8, open drain)
  Vcc1: 2.313V,  Vcc2: 1.11V, Reset lasts for 210ms, resetin=0.625V.
  A watchdog startup delay of 54s after reset asserts allows system initialization during power-up. The watchdog operates in normal mode with a 1.68s delay after initialization.
- Connects to 2 adjacent I/O pins on any FPGA bank that has 3.3V power.
- (near J24) Silkscreen: "Short for Master"
- (near J24) Place all master jumpers together
- This RESET circuit complements the reset circuit on page 7 of the ML402 schematic.
  Replace the pushbutton switch on that page with the TP11SH8ABE, wich goes to the front panel.
- McGill Digital fMUX FPGA Motherboard
- Watchdog and Reset
- 03
- N.Starinski, UdeM
- (in symbol MAX6734) MAXIM

### Library data of the parts
DS16 = LED3: LED 0805 LTST-C170CKT; Published: 8-Jun-2000; LatestRevisionDate: 17-Dec-2003; LatestRevisionNote: PCB Footprint replaced.; Publisher: Altium Limited
J24 = Jumper_100mil: Header, 0.1" 2-Pin straight
R127 R129 = Res Semi: Semiconductor Resistor; Published: 8-Jun-2000; LatestRevisionDate: 17-Jul-2002; LatestRevisionNote: Re-released for DXP Platform.; Publisher: Altium Limited
R128 R130-R135 = Res Semi: Resistor 0603; Published: 8-Jun-2000; LatestRevisionDate: 17-Jul-2002; LatestRevisionNote: Re-released for DXP Platform.; Publisher: Altium Limited
U29 = MAX6734: uP Supervisory Circuit

## Sheet Comm_SQUID.SchDoc: FPGA Motherboard for Digital Multiplexed Readout, McGill U.
size B; DocumentNumber: DfMUX19; Revision: Rev0, Prototype; SheetNumber: 19; SheetTotal: 27; PageSetup: Record=PageOptions|CenterHorizontal=True|CenterVertical=True|PrintScale=0.73|XCorrection=1.00|YCorrection=1.00|PrintKind=0|BorderSize=5000000|LeftOffset=0|BottomOffset=0|Orientation=2|PaperLength=1000|PaperWidth=1000|Scale=100|PaperSource=15|PrintQuality=600|MediaType=1|DitherType=10|PaperKind=Letter|PrintScaleMode=1
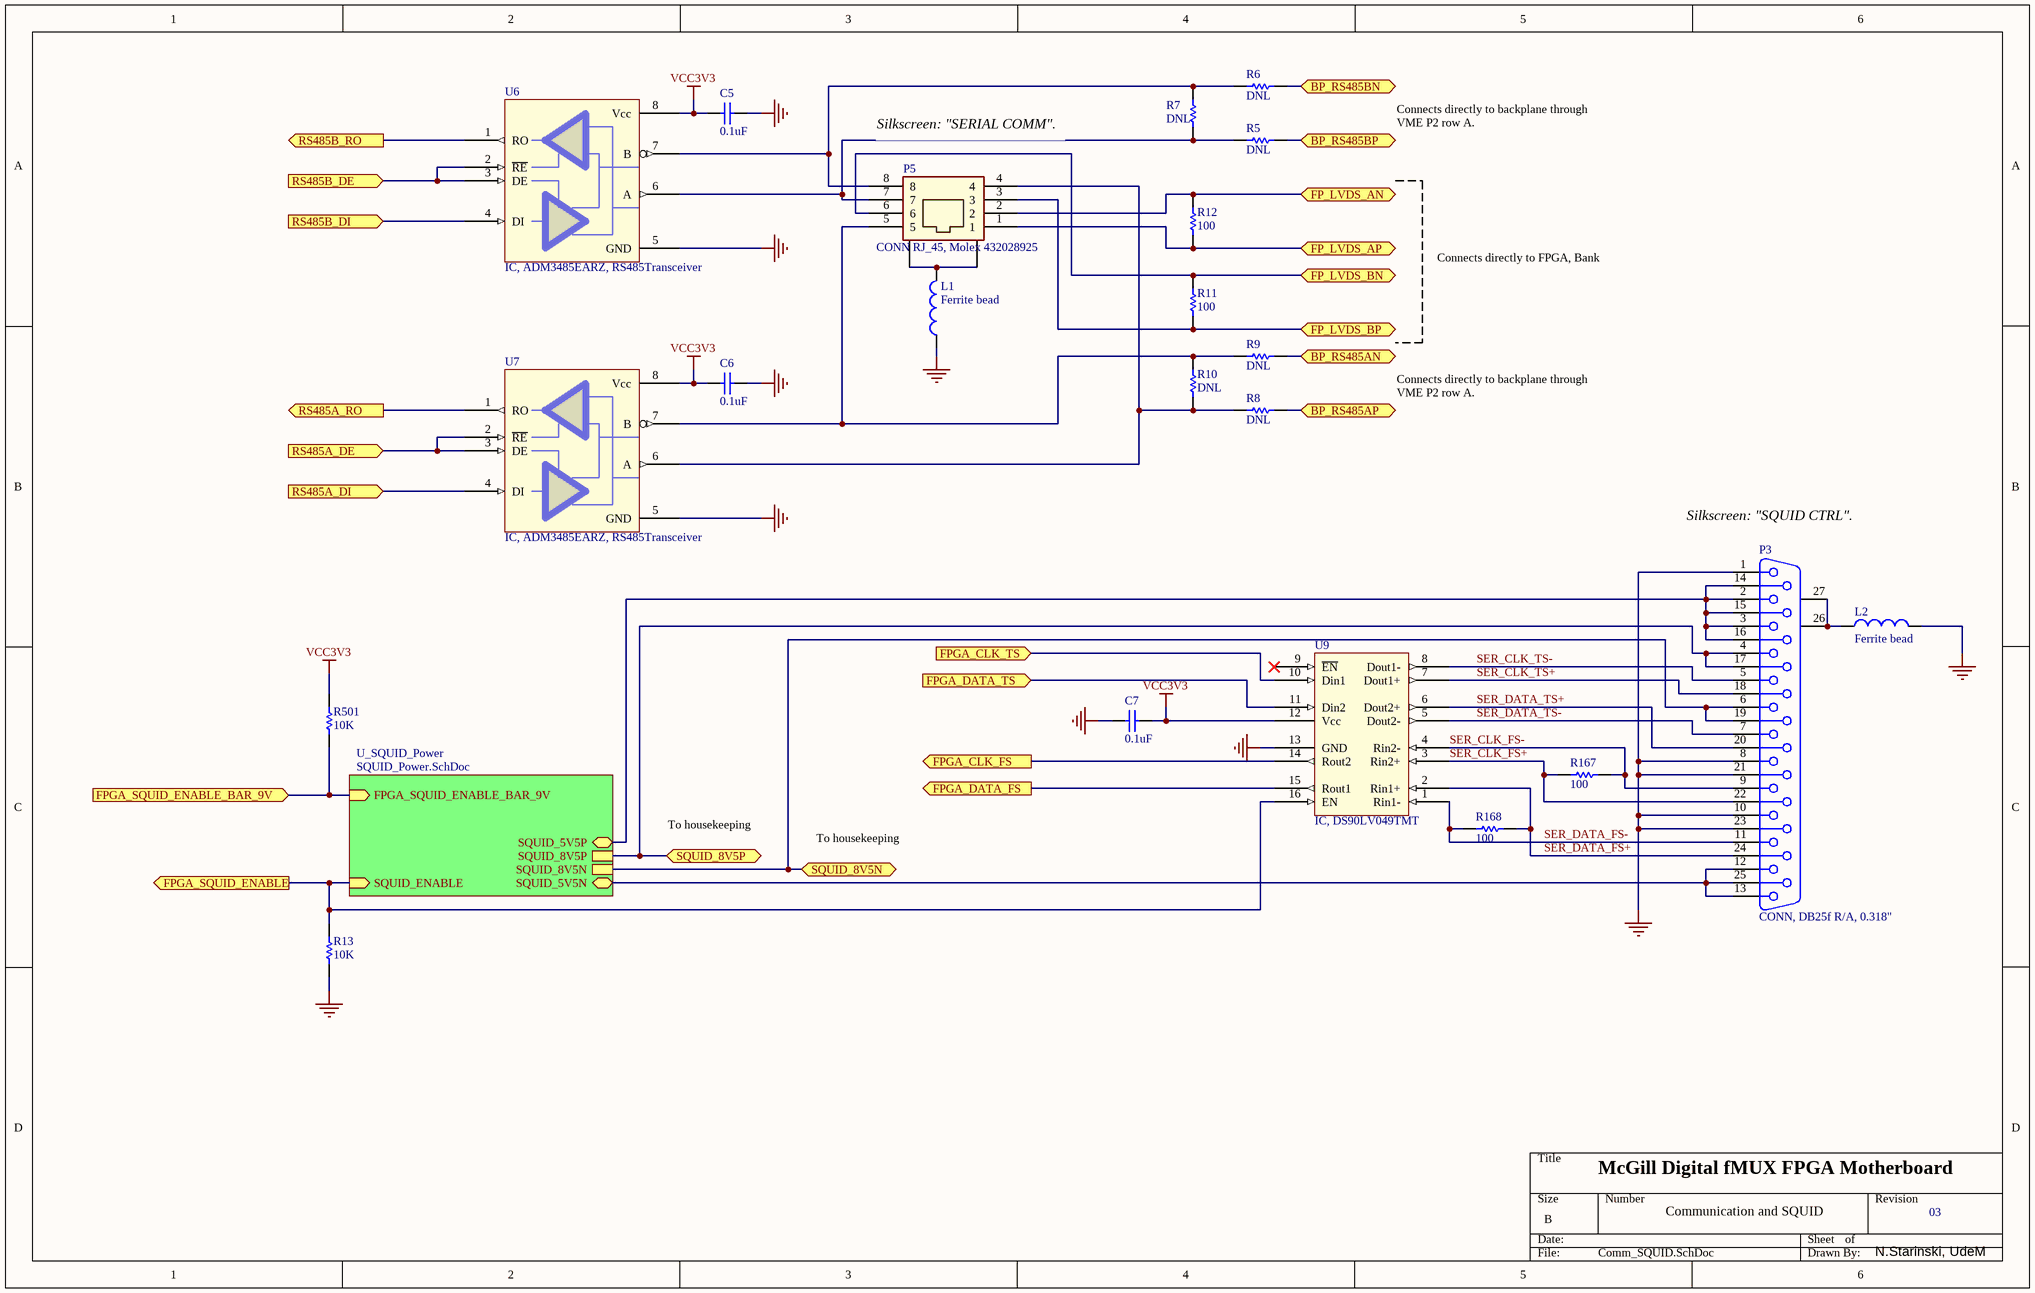
[diagram p24: Comm_SQUID.SchDoc]

### Parts
C5  0.1uF  [CC1608-0603]
C6  0.1uF  [CC1608-0603]
C7  0.1uF  [CC1608-0603]
L1  Ferrite bead  [INDC2012-0805]
L2  Ferrite bead  [INDC2012-0805]
P3  CONN, DB25f R/A, 0.318"  [DSUB1.385-2H25A]
P5  CONN RJ_45, Molex 432028925  [RJ45]
R5  DNL  [CR1608-0603]
R6  DNL  [CR1608-0603]
R7  DNL  [CR1608-0603]
R8  DNL  [CR1608-0603]
R9  DNL  [CR1608-0603]
R10  DNL  [CR1608-0603]
R11  100  [CR1608-0603]
R12  100  [CR1608-0603]
R13  10K  [CR1608-0603]
R167  100  [CR1608-0603]
R168  100  [CR1608-0603]
R501  10K  [1608[0603]]
U6  IC, ADM3485EARZ, RS485Transceiver  [SO-G8/Y1.9]
U7  IC, ADM3485EARZ, RS485Transceiver  [SO-G8/Y1.9]
U9  IC, DS90LV049TMT  [TSSO5x6-G16]

### Sub-sheets
U_SQUID_Power = SQUID_Power.SchDoc: SQUID_ENABLE (in), SQUID_5V5P (bidir), SQUID_5V5N (bidir), SQUID_8V5P, SQUID_8V5N, FPGA_SQUID_ENABLE_BAR_9V (in)

### Ports
BP_RS485AN (bidir), BP_RS485AP (bidir), BP_RS485BN (bidir), BP_RS485BP (bidir), FP_LVDS_AN (bidir), FP_LVDS_AP (bidir), FP_LVDS_BN (bidir), FP_LVDS_BP (bidir), FPGA_CLK_FS (out), FPGA_CLK_TS (in), FPGA_DATA_FS (out), FPGA_DATA_TS (in), FPGA_SQUID_ENABLE (out), FPGA_SQUID_ENABLE_BAR_9V (in), RS485A_DE (in), RS485A_DI (in), RS485A_RO (out), RS485B_DE (in), RS485B_DI (in), RS485B_RO (out), SQUID_8V5N, SQUID_8V5P

### Nets
GND: C5.2 C6.2 C7.1 L1.1 L2.2 P3.1 P3.8 P3.10 P3.21 P3.23 R13.1 U6.5(GND) U7.5(GND) U9.13(GND)
VCC3V3: C5.1 C6.1 C7.2 R501.2 U6.8(Vcc) U7.8(Vcc) U9.12(Vcc)
BP_RS485AN: R9.2 ; port BP_RS485AN
BP_RS485AP: R8.2 ; port BP_RS485AP
BP_RS485BN: R6.2 ; port BP_RS485BN
BP_RS485BP: R5.2 ; port BP_RS485BP
FP_LVDS_AN: P5.2 R12.2 ; port FP_LVDS_AN
FP_LVDS_AP: P5.1 R12.1 ; port FP_LVDS_AP
FP_LVDS_BN: P5.6 R11.2 ; port FP_LVDS_BN
FP_LVDS_BP: P5.3 R11.1 ; port FP_LVDS_BP
FPGA_CLK_FS: U9.14(Rout2) ; port FPGA_CLK_FS
FPGA_CLK_TS: U9.10(Din1) ; port FPGA_CLK_TS
FPGA_DATA_FS: U9.15(Rout1) ; port FPGA_DATA_FS
FPGA_DATA_TS: U9.11(Din2) ; port FPGA_DATA_TS
FPGA_SQUID_ENABLE: R13.2 U9.16(EN) ; port FPGA_SQUID_ENABLE, sheet U_SQUID_Power/SQUID_ENABLE
RS485A_DE: U7.2(~{RE}) U7.3(DE) ; port RS485A_DE
RS485A_DI: U7.4(DI) ; port RS485A_DI
RS485A_RO: U7.1(RO) ; port RS485A_RO
RS485B_DE: U6.2(~{RE}) U6.3(DE) ; port RS485B_DE
RS485B_DI: U6.4(DI) ; port RS485B_DI
RS485B_RO: U6.1(RO) ; port RS485B_RO
SER_CLK_FS+: P3.22 R167.1 U9.3(Rin2+)  [project net SER_CLK_FS+_19]
SER_CLK_FS-: P3.9 R167.2 U9.4(Rin2-)  [project net SER_CLK_FS-_19]
SER_CLK_TS+: P3.18 U9.7(Dout1+)  [project net SER_CLK_TS+_19]
SER_CLK_TS-: P3.5 U9.8(Dout1-)  [project net SER_CLK_TS-_19]
SER_DATA_FS+: P3.24 R168.2 U9.2(Rin1+)  [project net SER_DATA_FS+_19]
SER_DATA_FS-: P3.11 R168.1 U9.1(Rin1-)  [project net SER_DATA_FS-_19]
SER_DATA_TS+: P3.20 U9.6(Dout2+)  [project net SER_DATA_TS+_19]
SER_DATA_TS-: P3.7 U9.5(Dout2-)  [project net SER_DATA_TS-_19]
SQUID9V_EN: R501.1 ; port FPGA_SQUID_ENABLE_BAR_9V, sheet U_SQUID_Power/FPGA_SQUID_ENABLE_BAR_9V
SQUID_8V5N: P3.6 P3.19 ; port SQUID_8V5N, sheet U_SQUID_Power/SQUID_8V5N
SQUID_8V5P: P3.4 P3.17 ; port SQUID_8V5P, sheet U_SQUID_Power/SQUID_8V5P
NetC328_1: P3.2 P3.3 P3.14 P3.15 P3.16 ; sheet U_SQUID_Power/SQUID_5V5P
NetC331_2: P3.12 P3.13 P3.25 ; sheet U_SQUID_Power/SQUID_5V5N
NetL1_2: L1.2 P5.9(GND) P5.10(GND)
NetL2_1: L2.1 P3.26(MH1) P3.27(MH2)
NetP5_4: P5.4 R8.1 R10.1 U7.6(A)
NetP5_5: P5.5 R9.1 R10.2 U7.7(B)
NetP5_7: P5.7 R5.1 R7.1 U6.6(A)
NetP5_8: P5.8 R6.1 R7.2 U6.7(B)

Not connected (* = marked no-connect by the designer): U9 9(~{EN})*

### Notes on the sheet
- (near P5) Silkscreen: "SERIAL COMM".
- Connects directly to backplane through VME P2 row A.
- Connects directly to FPGA, Bank 7.
- (near P3) Silkscreen: "SQUID CTRL".
- To housekeeping
- McGill Digital fMUX FPGA Motherboard
- Communication and SQUID
- 03
- N.Starinski, UdeM

### Library data of the parts
C5-C7 = Cap Semi: Capacitor (Semiconductor SIM Model); Published: 8-Jun-2000; LatestRevisionDate: 17-Jul-2002; LatestRevisionNote: Re-released for DXP Platform.; PackageReference: C1206; Publisher: Altium Limited
L1 L2 = Inductor: Inductor SM 0805; Code_IEC: 1005; Published: 8-Jun-2000; LatestRevisionDate: 17-Jul-2002; LatestRevisionNote: Re-released for DXP Platform.; PackageReference: 0402-A; Publisher: Altium Limited; Code_JEITA: 0402
P3 = D Connector 25: Amp 5747846-4 or ITT DBMG25SJA197; PackageDocument: U; Positions: 25; Gender: Receptacle; Published: 15-Jun-2001; LatestRevisionDate: 17-Jul-2002; LatestRevisionNote: Re-released for DXP Platform.; DatasheetDocument: 19-Mar-1999; PackageReference: 787202; Publisher: Altium Limited; Orientation: Right Angle
P5 = RJ_45: Molex 432028925
R5-R12 R167 R168 R501 = Res Semi: Semiconductor Resistor; Published: 8-Jun-2000; LatestRevisionDate: 17-Jul-2002; LatestRevisionNote: Re-released for DXP Platform.; Publisher: Altium Limited
  R501: PackageReference: AXIAL-0.5; Value: 10K
R13 = Res Semi: Resistor 0603; Published: 8-Jun-2000; LatestRevisionDate: 17-Jul-2002; LatestRevisionNote: Re-released for DXP Platform.; Publisher: Altium Limited
U6 U7 = ADM3485: 20 Mbps, EIA RS-485 Transceiver
U9 = DS90LV049: 3V LVDS Dual Line Transceiver

## Sheet SQUID_Power.SchDoc: FPGA Motherboard for Digital Multiplexed Readout, McGill U.
size A portrait; DocumentNumber: DfMUX20; Revision: Rev0, Prototype; SheetNumber: 20; SheetTotal: 27; PageSetup: Record=PageOptions|CenterHorizontal=True|CenterVertical=True|PrintScale=1.05|XCorrection=1.00|YCorrection=1.00|PrintKind=0|BorderSize=5000000|LeftOffset=0|BottomOffset=0|Orientation=1|PaperLength=1000|PaperWidth=1000|Scale=100|PaperSource=1|PrintQuality=300|MediaType=1|DitherType=10|PaperKind=Letter|PrintScaleMode=1
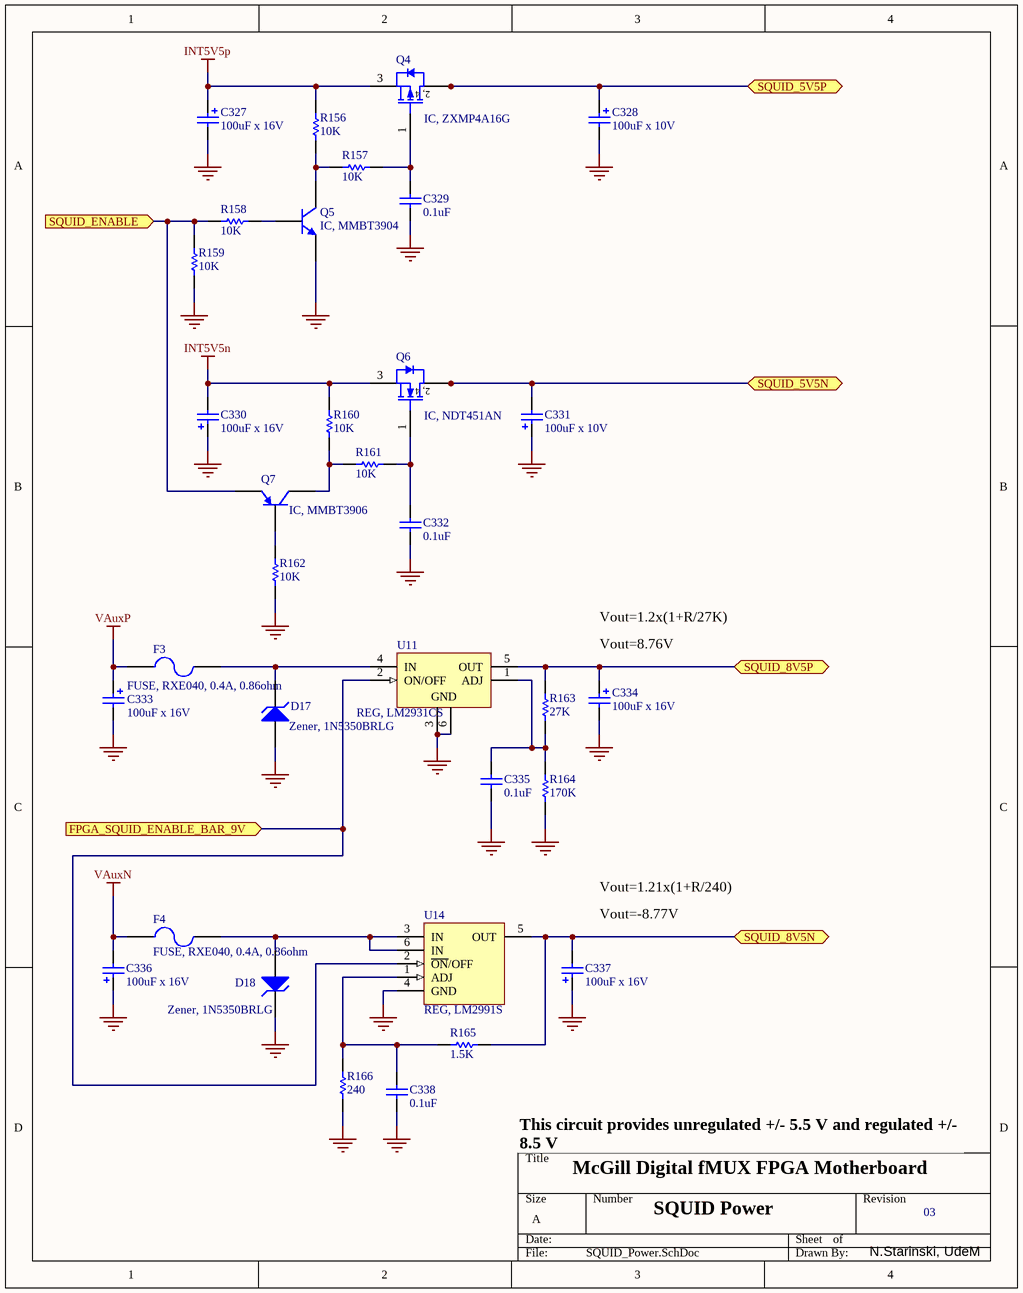
[diagram p25: SQUID_Power.SchDoc]

### Parts
C327  100uF x 16V  [CC7343-31_Dsize]
C328  100uF x 10V  [TC6032-2412]
C329  0.1uF  [CC1608-0603]
C330  100uF x 16V  [CC7343-31_Dsize]
C331  100uF x 10V  [TC6032-2412]
C332  0.1uF  [CC1608-0603]
C333  100uF x 16V  [CC7343-31_Dsize]
C334  100uF x 16V  [CC7343-31_Dsize]
C335  0.1uF  [CC1608-0603]
C336  100uF x 16V  [CC7343-31_Dsize]
C337  100uF x 16V  [CC7343-31_Dsize]
C338  0.1uF  [CC1608-0603]
D17  Zener, 1N5350BRLG  [A-500]
D18  Zener, 1N5350BRLG  [A-500]
F3  FUSE, RXE040, 0.4A, 0.86ohm  [Fuse 5.88mm]
F4  FUSE, RXE040, 0.4A, 0.86ohm  [Fuse 5.88mm]
Q4  IC, ZXMP4A16G  [SOT223]
Q5  IC, MMBT3904  [SOT23]
Q6  IC, NDT451AN  [SOT223]
Q7  IC, MMBT3906  [SOT23]
R156  10K  [CR1608-0603]
R157  10K  [CR1608-0603]
R158  10K  [CR1608-0603]
R159  10K  [CR1608-0603]
R160  10K  [CR1608-0603]
R161  10K  [CR1608-0603]
R162  10K  [CR1608-0603]
R163  27K  [CR1608-0603]
R164  170K  [CR1608-0603]
R165  1.5K  [CR1608-0603]
R166  240  [CR1608-0603]
U11  REG, LM2931CS  [TS5B]
U14  REG, LM2991S  [TS5B]

### Ports
FPGA_SQUID_ENABLE_BAR_9V (in), SQUID_5V5N (bidir), SQUID_5V5P (bidir), SQUID_8V5N, SQUID_8V5P, SQUID_ENABLE (in)

### Nets
GND: C327.2 C328.2 C329.1 C330.1 C331.1 C332.1 C333.2 C334.2 C335.1 C336.1 C337.1 C338.1 D17.1(A) D18.2(K) Q5.2(E) R159.1 R162.1 R164.1 R166.1 U11.3(GND) U11.6(GND_(TAB)) U14.4(GND)
INT5V5n: C330.2 Q6.3(S) R160.2
INT5V5p: C327.1 Q4.3(S) R156.2
VAuxN: C336.2 F4.1
VAuxP: C333.1 F3.1
FPGA_SQUID_ENABLE: Q7.2(E) R158.1 R159.2 ; port SQUID_ENABLE
SQUID9V_EN: U11.2(ON/OFF) U14.2(~{ON}/OFF) ; port FPGA_SQUID_ENABLE_BAR_9V
SQUID_8V5N: C337.2 R165.2 U14.5(OUT) ; port SQUID_8V5N
SQUID_8V5P: C334.1 R163.2 U11.5(OUT) ; port SQUID_8V5P
NetC328_1: C328.1 Q4.2(D) Q4.4(D) ; port SQUID_5V5P
NetC329_2: C329.2 Q4.1(G) R157.2
NetC331_2: C331.2 Q6.2(D) Q6.4(D) ; port SQUID_5V5N
NetC332_2: C332.2 Q6.1(G) R161.2
NetC335_2: C335.2 R163.1 R164.2 U11.1(ADJ)
NetC338_2: C338.2 R165.1 R166.2 U14.1(ADJ)
NetD17_2: D17.2(K) F3.2 U11.4(IN)
NetD18_1: D18.1(A) F4.2 U14.3(IN) U14.6(IN)
NetQ5_1: Q5.1(B) R158.2
NetQ5_3: Q5.3(C) R156.1 R157.1
NetQ7_1: Q7.1(B) R162.2
NetQ7_3: Q7.3(C) R160.1 R161.1

### Notes on the sheet
- Vout=1.2x(1+R/27K)
- (near C334) Vout=8.76V
- Vout=1.21x(1+R/240)
- (near C337) Vout=-8.77V
- This circuit provides unregulated +/- 5.5 V and regulated +/- 8.5 V
  to a DB25F port which is used to power the SQUID controller.
- McGill Digital fMUX FPGA Motherboard
- SQUID Power
- 03
- N.Starinski, UdeM
- (in symbol ZXMN10A11G) 2, 4
- (in symbol ZXMP4A16G) 2, 4

### Library data of the parts
C327 C330 C333 C334 C336 C337 = Cap Pol3: CAP TANTD TPSD107M016R0060; Published: 8-Jun-2000; LatestRevisionDate: 17-Jul-2002; LatestRevisionNote: Re-released for DXP Platform.; PackageReference: C0805; Publisher: Altium Limited
C328 C331 = Cap Pol3: CAP TANTC TPSC107K010R0075; Published: 8-Jun-2000; LatestRevisionDate: 17-Jul-2002; LatestRevisionNote: Re-released for DXP Platform.; PackageReference: C0805; Publisher: Altium Limited
C329 C332 C335 C338 = Cap Semi: Capacitor (Semiconductor SIM Model); Published: 8-Jun-2000; LatestRevisionDate: 17-Jul-2002; LatestRevisionNote: Re-released for DXP Platform.; PackageReference: C1206; Publisher: Altium Limited
D17 D18 = 1N5350B: Zener Diode, 13V, 5W; Published: 8-Jun-2000; LatestRevisionDate: 17-Jul-2002; LatestRevisionNote: Re-released for DXP Platform.; PackageReference: A-500; Publisher: Altium Limited; ComponentLink1Description: Manufacturer Link; ComponentLink1URL: http://www.vishay.com/
F3 F4 = Fuse 2: Fuse; Published: 8-Jun-2000; LatestRevisionDate: 17-Jul-2002; LatestRevisionNote: Re-released for DXP Platform.; Publisher: Altium Limited
Q4 = ZXMP4A16G: 40V P-Channel Enhancement Mode MOSFET; PackageDocument: 2002; Published: 17-Dec-2003; DatasheetDocument: Jul-03; PackageReference: SOT223; Publisher: Altium Limited; Code_JEDEC: TO-261-AA-B; ComponentLink1Description: Manufacturer Link; ComponentLink1URL: http://www.zetex.com/; ComponentLink2Description: Datasheet; ComponentLink2URL: www.zetex.com/3.0/pdf/ZXMP4A16G.pdf
Q5 = MMBT3904: NPN Switching Transistor; Published: 17-Sep-2003; DatasheetDocument: 13-May-2002; PackageDocument: May-1999; PackageReference: SOT23; Publisher: Altium Limited; ComponentLink1Description: Manufacturer Link; ComponentLink1URL: http://www.semiconductors.philips.com/; ComponentLink2Description: Datasheet; ComponentLink2URL: http://www.semiconductors.philips.com/acrobat/datasheets/MMBT3904_4.pdf
Q6 = ZXMN10A11G: 100V N-Channel Enhancement Mode MOSFET; PackageDocument: 2002; Published: 17-Dec-2003; DatasheetDocument: Mar-02; PackageReference: SOT223; Publisher: Altium Limited; Code_JEDEC: TO-261-AA-B; ComponentLink1Description: Manufacturer Link; ComponentLink1URL: http://www.zetex.com/; ComponentLink2Description: Datasheet; ComponentLink2URL: www.zetex.com/3.0/pdf/ZXMN10A11G.pdf
Q7 = MMBT3906: PNP Switching Transistor; Published: 17-Sep-2003; DatasheetDocument: 11-Apr-2000; PackageDocument: May-1999; PackageReference: SOT23; Publisher: Altium Limited; ComponentLink1Description: Manufacturer Link; ComponentLink1URL: http://www.semiconductors.philips.com/; ComponentLink2Description: Datasheet; ComponentLink2URL: http://www.semiconductors.philips.com/acrobat/datasheets/MMBT3906_2.pdf
R156-R166 = Res Semi: Resistor 0603; Published: 8-Jun-2000; LatestRevisionDate: 17-Jul-2002; LatestRevisionNote: Re-released for DXP Platform.; Publisher: Altium Limited
U11 = LM2931CS: Series Low-Dropout Regulator; Note: Tab is GND; Published: 15-Apr-2002; DatasheetDocument: Apr-1998; PackageReference: TS5B; Publisher: Altium Limited; ComponentLink1Description: Manufacturer Link; ComponentLink1URL: http://www.national.com/
U14 = LM2991S: Negative Low-Dropout Adjustable Regulator; Note: Tab is Input; Published: 15-Apr-2002; DatasheetDocument: May-1999; PackageReference: TS5B; Publisher: Altium Limited; ComponentLink1Description: Manufacturer Link; ComponentLink1URL: http://www.national.com/